# EAGLE design SCS (EAGLE 9.3.0)
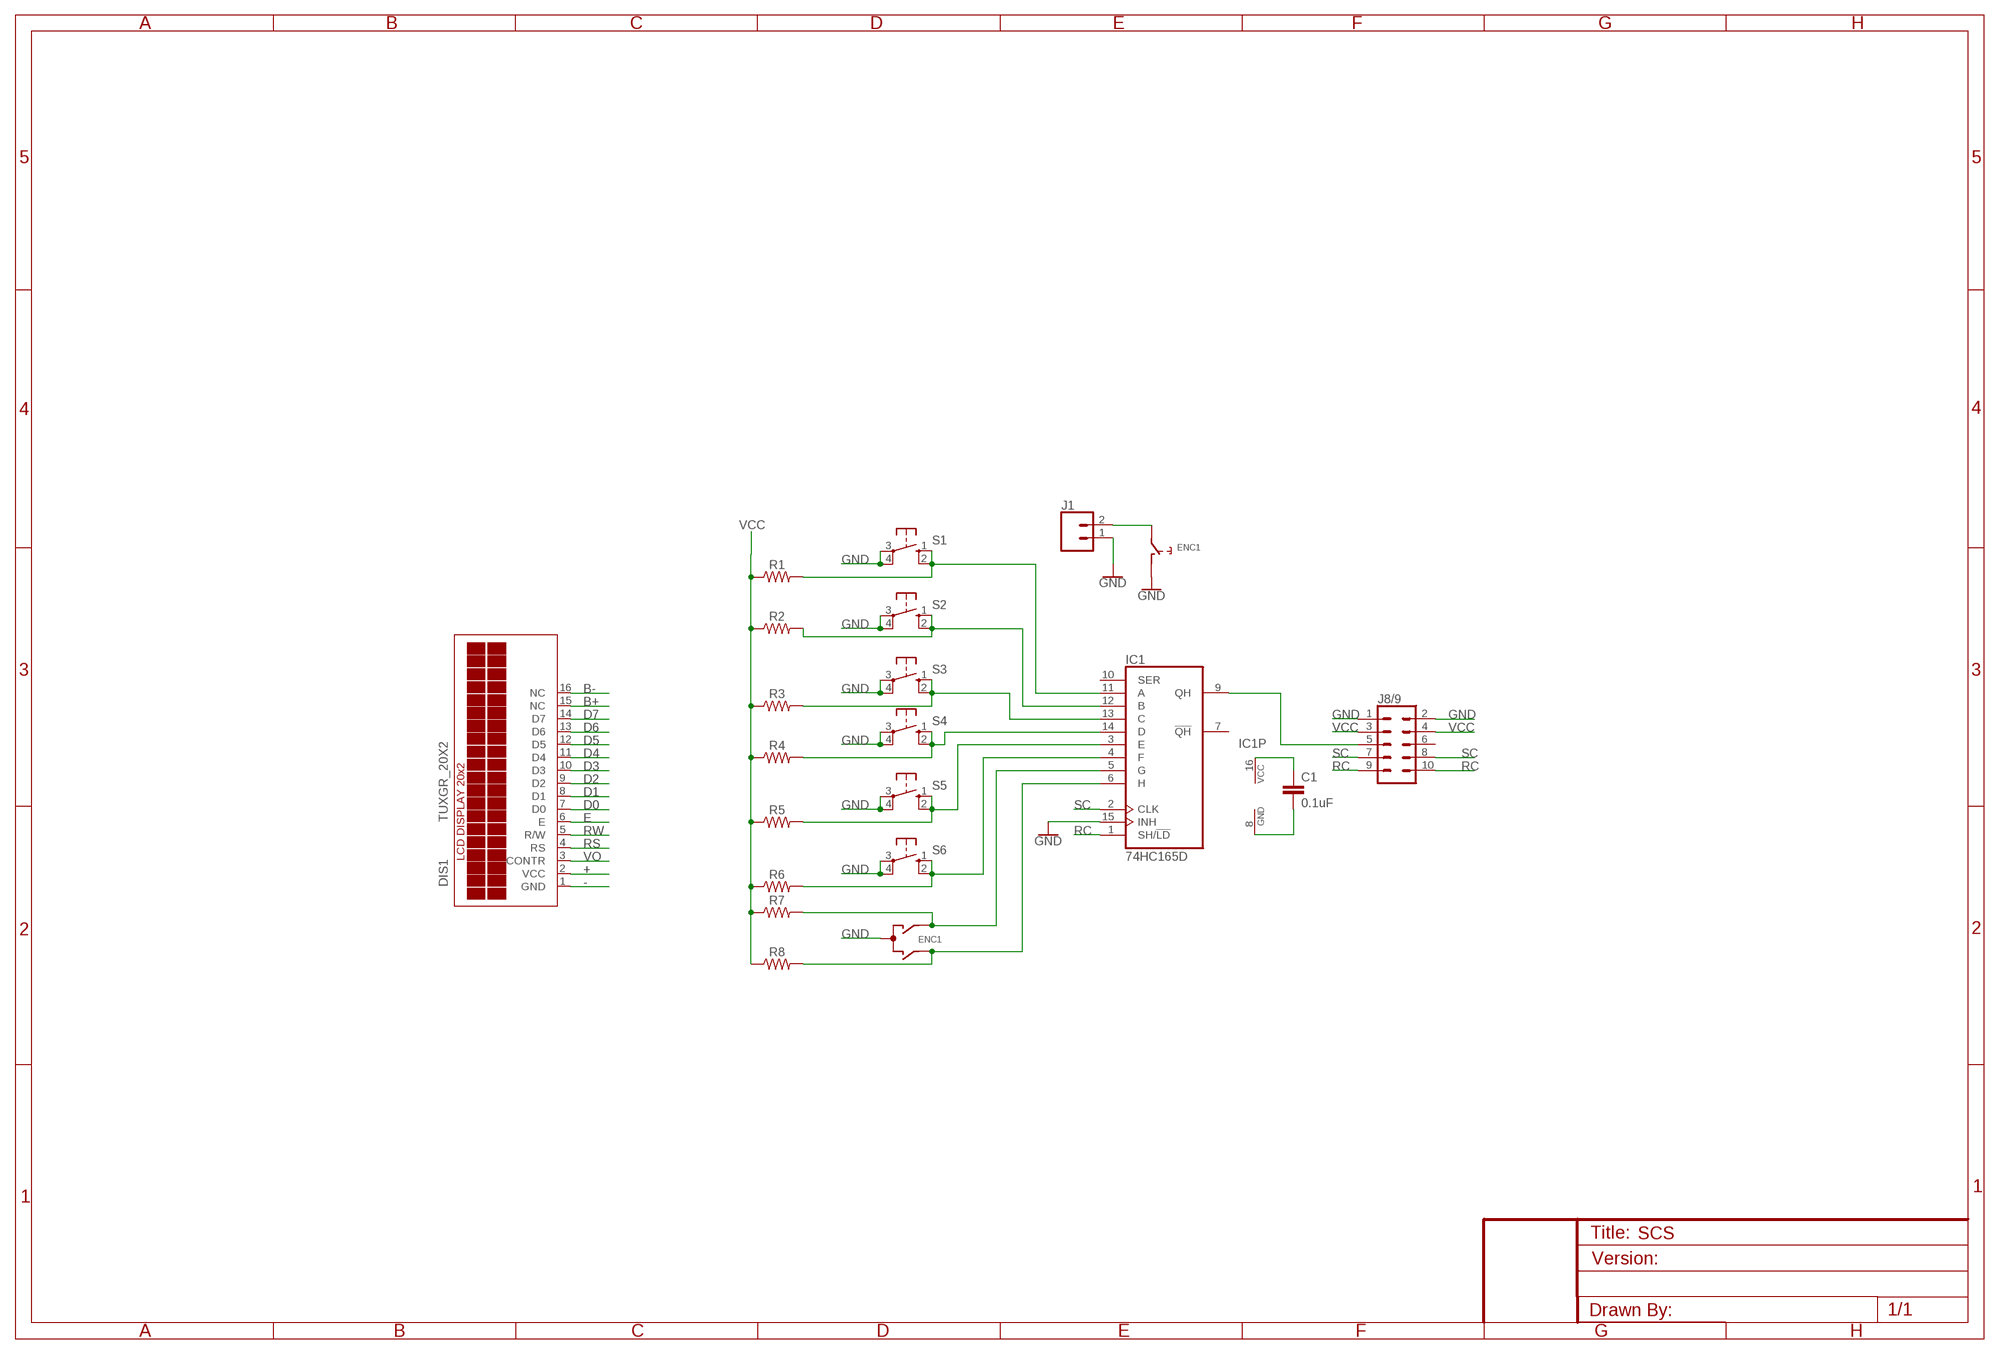
[diagram p0: schematic, sheet 1]

## Parts
C1  0.1uF  0.1UF-0603-25V-(+80/-20%)  [0603]
DIS1  TUXGR_20X2  [TUXGR_20X2]
ENC1  EC12E_SW  [ALPS_EC12E_SW]
IC1  74HC165D  [SO16]
J1  CONN_02  [1X02]
J8/9  CONN_05X2SHD_LOCK  [2X5-SHROUDED_LOCK]
R1  10k  10KOHM-0603-1/10W-1%  [0603]
R2  10k  10KOHM-0603-1/10W-1%  [0603]
R3  10k  10KOHM-0603-1/10W-1%  [0603]
R4  10k  10KOHM-0603-1/10W-1%  [0603]
R5  10k  10KOHM-0603-1/10W-1%  [0603]
R6  10k  10KOHM-0603-1/10W-1%  [0603]
R7  10k  10KOHM-0603-1/10W-1%  [0603]
R8  10k  10KOHM-0603-1/10W-1%  [0603]
S1  40-XX  [B3F-40XX]
S2  40-XX  [B3F-40XX]
S3  40-XX  [B3F-40XX]
S4  40-XX  [B3F-40XX]
S5  40-XX  [B3F-40XX]
S6  40-XX  [B3F-40XX]

## Nets
+: DIS1.2(VCC)
-: DIS1.1(GND)
B+: DIS1.15(NC)
B-: DIS1.16(NC)
D0: DIS1.7(D0)
D1: DIS1.8(D1)
D2: DIS1.9(D2)
D3: DIS1.10(D3)
D4: DIS1.11(D4)
D5: DIS1.12(D5)
D6: DIS1.13(D6)
D7: DIS1.14(D7)
E: DIS1.6(E)
GND: ENC1.C ENC1.D IC1.15(INH) J1.1 J8/9.1 J8/9.2 S1.3(P) S1.4(P1) S2.3(P) S2.4(P1) S3.3(P) S3.4(P1) S4.3(P) S4.4(P1) S5.3(P) S5.4(P1) S6.3(P) S6.4(P1)
N$1: IC1.3(E) R5.2 S5.1(S) S5.2(S1)
N$2: ENC1.A IC1.5(G) R7.2
N$3: IC1.4(F) R6.2 S6.1(S) S6.2(S1)
N$4: IC1.9(QH) J8/9.5
N$5: IC1.14(D) R4.2 S4.1(S) S4.2(S1)
N$6: IC1.13(C) R3.2 S3.1(S) S3.2(S1)
N$7: IC1.12(B) R2.2 S2.1(S) S2.2(S1)
N$8: IC1.11(A) R1.2 S1.1(S) S1.2(S1)
N$9: ENC1.B IC1.6(H) R8.2
N$11: ENC1.E J1.2
N$12: C1.1 IC1.16(VCC)
N$13: C1.2 IC1.8(GND)
RC: IC1.1(SH/!LD) J8/9.9 J8/9.10
RS: DIS1.4(RS)
RW: DIS1.5(R/W)
SC: IC1.2(CLK) J8/9.7 J8/9.8
VCC: J8/9.3 J8/9.4 R1.1 R2.1 R3.1 R4.1 R5.1 R6.1 R7.1 R8.1
VO: DIS1.3(CONTR)
Unconnected: ENC1.GND1(G) ENC1.GND2(G) IC1.7(!QH) IC1.10(SER) J8/9.6

## Library data of the parts
C1 = SparkFun-Capacitors:0.1UF: 0.1µF ceramic capacitors A capacitor is a passive two-terminal electrical component used to store electrical energy temporarily in an electric field.; PROD_ID: CAP-00810
DIS1 = display-lcd:TUXGR_20X2: Tuxgraphics LCD display 20x2 characters reflective, without background light Source: tuxgr_20x2.pdf; OC_FARNELL: unknown; OC_NEWARK: unknown
ENC1 = switch-alps:EC12E_SW: ALPS rotary Encoder EC12E series with switch; MPN: EC12E2424407; OC_FARNELL: 1520813; OC_NEWARK: 74M1068
IC1 = 74xx-eu:74*165: 8-bit parallel load SHIFT REGISTER
J1 = SparkFun-Connectors:CONN_02: Multi connection point. Often used as Generic Header-pin footprint for 0.1 inch spaced/style header connections On any of the 0.1 inch spaced packages, you can populate with these: Break Away Headers - Straight <https://www.sparkfun.com/products/116> (PRT-00116) Break Away Male Headers - Right Angle <https://www.sparkfun.com/products/553> (PRT-00553) Female Headers <https://www.sparkfun.com/products/115> (PRT-00115) Break Away Headers - Machine Pin <https://www.sparkfun.com/products/117> (PRT-00117) Break Away Female Headers - Swiss Machine Pin <https://www.sparkfun.com/products/743> (PRT-00743) For SCREWTERMINALS and SPRING TERMINALS visit here: Screw Terimnals on SparkFun.com <https://www.sparkfun.com/search/results?term=Screw+Terminals> (5mm/3.5mm/2.54mm spacing) This device is also useful as a general connection point to wire up your design to another part of your project. Our various solder wires solder well into these plated through hole pads. Hook-Up Wire - Assortment (Stranded, 22 AWG) <https://www.sparkfun.com/products/11375> (PRT-11375) Hook-Up Wire - Assortment (Solid Core, 22 AWG) <https://www.sparkfun.com/products/11367> (PRT-11367) View the entire wire category on our website here <https://www.sparkfun.com/categories/141> Special notes: Molex polarized connector foot print use with: PRT-08233 with associated crimp pins and housings. 2.54_SCREWTERM for use with PRT-10571. 3.5mm Screw Terminal footprints for PRT-08084 5mm Screw Terminal footprints for use with PRT-08432
J8/9 = SparkFun-Connectors:CONN_05X2: Multi connection point. Often used as Generic Header-pin footprint for 0.1 inch spaced/style header connections For AVR SPI programming port, see special device with nice symbol: "AVR_SPI_PROG_5x2.dev" You can populate with any combo of single row headers, but if you'd like an exact match, check these: 2x5 AVR ICSP Male Header <https://www.sparkfun.com/products/778> (PRT-00778) 2x5 Pin Shrouded Header <https://www.sparkfun.com/products/8506> (PRT-08506) On any of the 0.1 inch spaced packages, you can populate with these: Break Away Headers - Straight <https://www.sparkfun.com/products/116> (PRT-00116) Break Away Male Headers - Right Angle <https://www.sparkfun.com/products/553> (PRT-00553) Female Headers <https://www.sparkfun.com/products/115> (PRT-00115) Break Away Headers - Machine Pin <https://www.sparkfun.com/products/117> (PRT-00117) Break Away Female Headers - Swiss Machine Pin <https://www.sparkfun.com/products/743> (PRT-00743) Special note: the shrouded connector mates well with our 5x2 ribbon cables: 2x5 Pin IDC Ribbon Cable <https://www.sparkfun.com/products/8535> (PRT-08535); PROD_ID: CONN-08671; SF_ID: PRT-08506
R1-R8 = SparkFun-Resistors:10KOHM: 10kΩ resistor A resistor is a passive two-terminal electrical component that implements electrical resistance as a circuit element. Resistors act to reduce current flow, and, at the same time, act to lower voltage levels within circuits. - Wikipedia; PROD_ID: RES-00824
S1-S6 = adafruit:40-XX: OMRON SWITCH; MF: OMRON COMPONENTS USA; MPN: B3F-4000; OC_FARNELL: 176434; OC_NEWARK: 36K3105

## Net classes
0 default: width 0.508 mm, drill 1.016 mm, clearance 0.508 mm

## Board
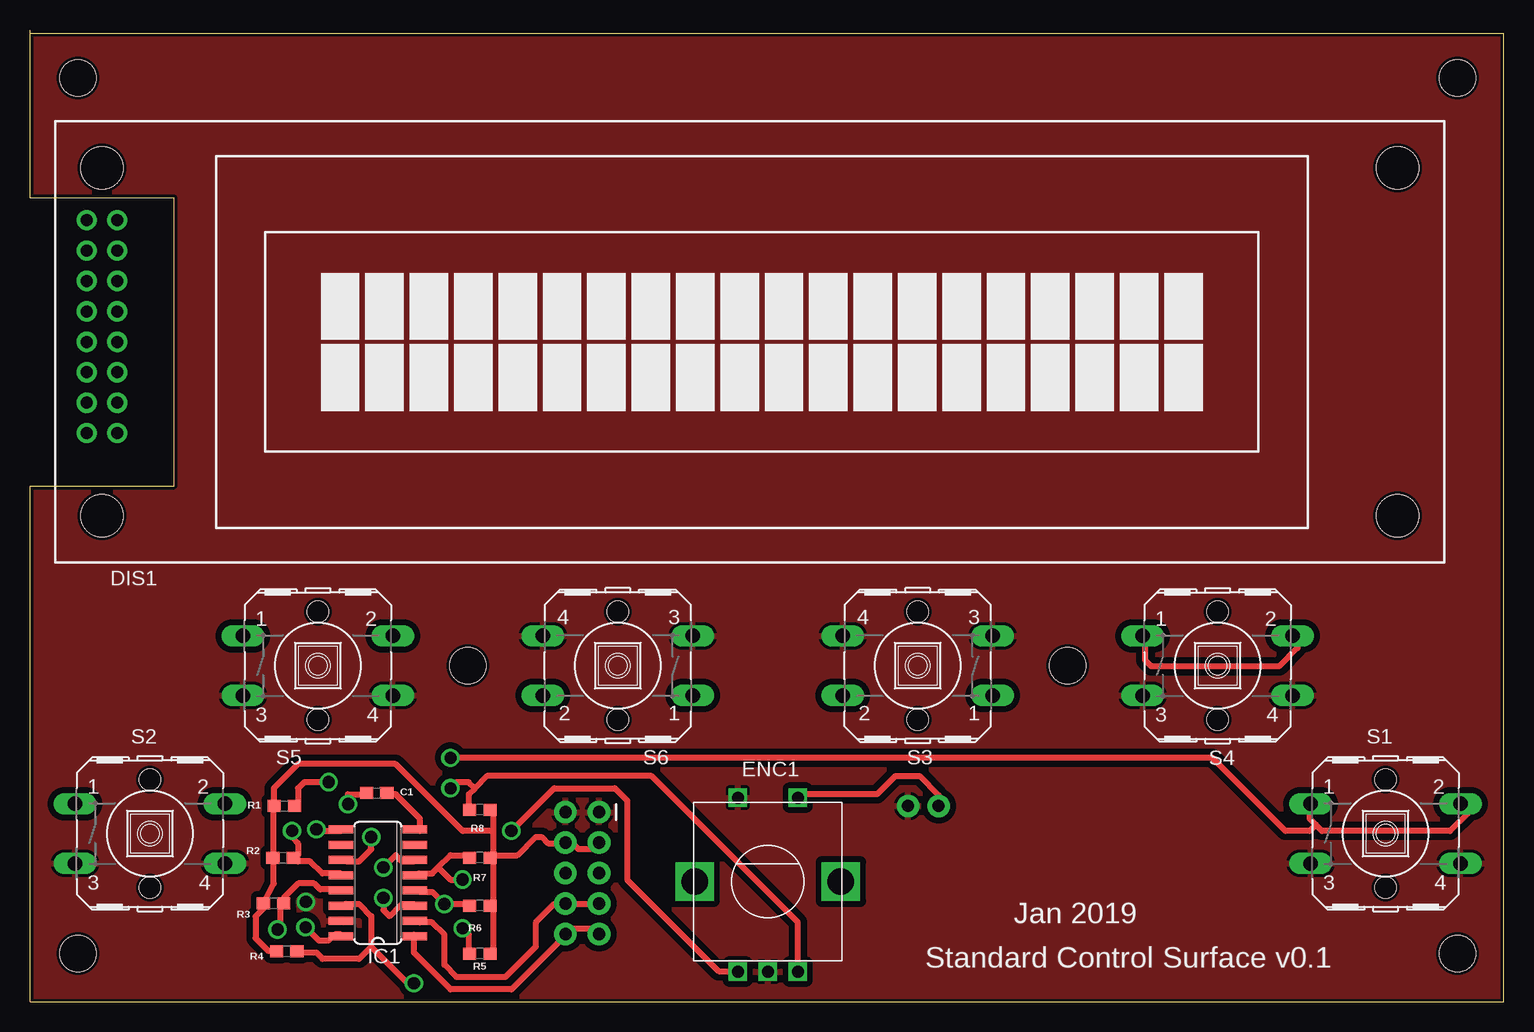
[diagram p1: board, top side]
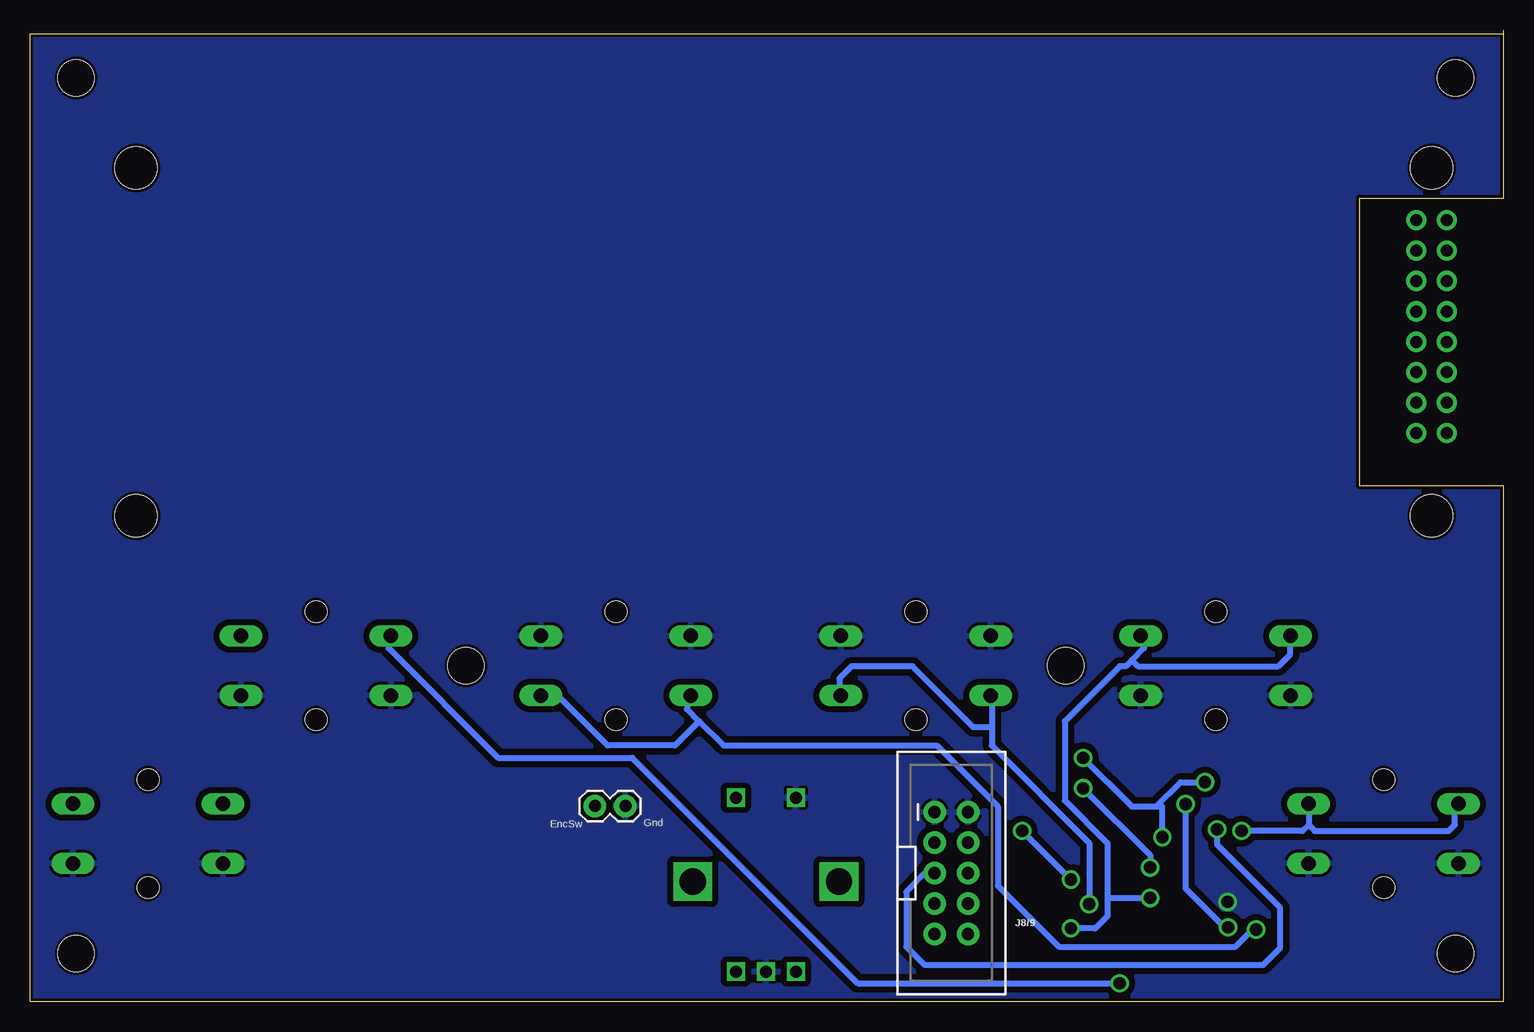
[diagram p2: board, bottom side, seen from below]

Size 122.84 x 81 mm. Coordinates in mm from the lower left corner, seen from the top.
Outline: 0,80.68 122.84,80.68 122.84,0 0,0 0,43 12,43 12,67 0,67 0,81
Copper layers (1*16): Top 0.035mm / dielectric 1.5mm / Bottom 0.035mm
Design rules "dirt_cheap_dirty_boards.v1.1": minimum track width 6mil, minimum drill 12mil, track to track 6mil, track to pad 6mil, pad to pad 6mil, via to via 6mil, smd to smd 0mil, copper to edge 10mil, drill to drill 10mil, minimum pad ring 10mil, minimum via ring 6mil, stop-mask expansion 2mil, vias tented up to drill 25mil, thermal gap 10mil
Holes 3 mm at 4,77 119,77 119,4 4,4 36.5,28 86.5,28

### Footprints (pad centres in the part's own frame; a part is rotated, then mirrored left to right if it is on the bottom)
0603 = smd 1.1 x 1: 1 -0.85,0; 2 0.85,0
TUXGR_20X2 = drill 1 pad 1.676: 1 -52.73,-7.62; 2 -55.27,-7.62; 3 -52.73,-5.08; 4 -55.27,-5.08; 5 -52.73,-2.54; 6 -55.27,-2.54; 7 -52.73,0; 8 -55.27,0; 9 -52.73,2.54; 10 -55.27,2.54; 11 -52.73,5.08; 12 -55.27,5.08; 13 -52.73,7.62; 14 -55.27,7.62; 15 -52.73,10.16; 16 -55.27,10.16 | hole 3.5: -54,-14.5; 54,-14.5; -54,14.5; 54,14.5
ALPS_EC12E_SW = drill 1 square: A -2.5,-7.5; B 2.5,-7.5; C 0,-7.5; D -2.5,7; E 2.5,7 | drill 2.2 square: GND1 -6.1,0; GND2 6.1,0
SO16 = smd 0.66 x 2.032: 1 -4.445,-3.073; 2 -3.175,-3.073; 3 -1.905,-3.073; 4 -0.635,-3.073; 5 0.635,-3.073; 6 1.905,-3.073; 7 3.175,-3.073; 8 4.445,-3.073; 9 4.445,3.073; 10 3.175,3.073; 11 1.905,3.073; 12 0.635,3.073; 13 -0.635,3.073; 14 -1.905,3.073; 15 -3.175,3.073; 16 -4.445,3.073
1X02 = drill 1.016 pad 1.88: 1 0,0; 2 2.54,0
2X5-SHROUDED_LOCK = drill 1.016 pad 1.88: 1 -1.397,5.08; 2 1.397,5.08; 3 -1.397,2.54; 4 1.397,2.54; 5 -1.397,0; 6 1.397,0; 7 -1.397,-2.54; 8 1.397,-2.54; 9 -1.397,-5.08; 10 1.397,-5.08
B3F-40XX = drill 1.194 long: 1 -6.248,2.489; 2 6.248,2.489; 3 -6.248,-2.489; 4 6.248,-2.489 | hole 1.803: 0,-4.496; 0,4.496

### Placement (x,y rotation side)
C1  28.9,17.4 0 top
DIS1  60,55 0 top
ENC1  61.5,10 0 top
IC1  29,9.9 90 top
J1  73.2,16.3 180 bottom
J8/9  46.04,10.71 0 bottom
R1  21.2,16.3 0 top
R2  21.1,12 0 top
R3  20.3,8.2 0 top
R4  21.4,4.2 0 top
R5  37.5,4 180 top
R6  37.5,8 180 top
R7  37.5,12 180 top
R8  37.5,16 180 top
S1  113,14 0 top
S2  10,14 0 top
S3  74,28 180 top
S4  99,28 0 top
S5  24,28 0 top
S6  49,28 180 top

### Tracks (layer width: path | path; a pad name or v marks a point on that pad's centre or on a via)
GND  (via drill 1.02)
  other vias: 23,8.3
  pour Top: -2,86 130,86 130,-6 -2,-6
  pour Bottom: -2,86 130,86 130,-6 -2,-6
N$1  (via drill 1.02)
  Top 0.508: v36.07,6.1 36.58,5.59 36.58,4.06 R5.2 | v29.46,8.64 29.46,7.62 29.97,7.11 30.99,8.13 32,8.13 IC1.3
  Bottom 0.508: v36.07,6.1 34.04,6.1 33.02,7.11 33.02,8.64 | 33.02,8.64 33.02,13.21 36.58,16.76 36.58,23.37 32,27.94 31.5,27.94 30.99,28.45 | 30.99,28.45 29.97,29.46 29.97,30.48 S5.2 | 33.02,8.64 v29.46,8.64 | 30.99,28.45 30.48,27.94 18.8,27.94 17.78,28.96 17.78,30.48 S5.1
N$2  (via drill 1.02)
  Top 0.508: 34.04,11.18 33.53,10.67 32.51,10.67 IC1.5 | 34.04,11.18 35.05,12.19 36.58,12.19 R7.2 | v40.13,14.22 43.69,17.78 48.77,17.78 49.78,16.76 49.78,10.16 57.4,2.54 58.93,2.54 ENC1.A | v36.07,10.16 35.05,10.16 34.04,11.18
  Bottom 0.508: v36.07,10.16 v40.13,14.22
N$3  (via drill 1.02)
  Top 0.508: R6.2 36.58,8.13 v34.54,8.13 33.53,9.14 32.51,9.14 IC1.4
  Bottom 0.508: v34.54,8.13 34.54,13.21 42.67,21.34 42.67,22.86 | 42.67,22.86 42.67,25.4 S6.2 | 42.67,22.86 44.2,22.86 49.28,27.94 54.36,27.94 55.37,26.92 55.37,25.91 S6.1
N$4  (via drill 1.02)
  Top 0.508: v23.88,14.35 24,14.22 25.91,14.22 IC1.9
  Bottom 0.508: v23.88,14.35 23.88,13.08 18.61,7.81 18.61,4.48 20.04,3.05 48.26,3.05 49.78,4.57 49.78,9.14 48.26,10.67 47.75,10.16 47.24,10.67 J8/9.5
N$5  (via drill 1.02)
  Top 0.508: 28.45,4.57 27.43,3.56 24.38,3.56 23.88,4.06 22.35,4.06 R4.2 | 28.45,4.57 28.45,7.11 27.43,8.13 26.42,8.13 IC1.14 | S4.1 92.96,30.48 92.96,28.45 93.47,27.94 104.14,27.94 105.66,29.46 105.66,30.48 S4.2 | 28.45,4.57 31.5,1.52 v32,1.52
  Bottom 0.508: v32,1.52 53.85,1.52 72.64,20.32 83.82,20.32 92.96,29.46 92.96,30.48 S4.1
N$6  (via drill 1.02)
  Top 0.508: IC1.13 25.85,9.34 24.19,9.34 23.68,9.85 22.37,9.85 21.15,8.63 R3.2 20.85,7.9 20.85,6.21 v20.64,6
  Bottom 0.508: v20.64,6 20.93,6 22.35,4.57 37.08,4.57 42.16,9.65 42.16,16.26 47.24,21.34 65.02,21.34 67.06,23.37 | 67.06,23.37 68.07,24.38 68.07,25.4 S3.2 | 67.06,23.37 69.09,21.34 74.68,21.34 78.74,25.4 79.76,25.4 S3.1
N$7  (via drill 1.02)
  Top 0.508: IC1.12 25.91,10.67 24.38,10.67 23.37,11.68 22.35,11.68 R2.2 22.35,12.19 22.35,13.21 21.84,13.72 v21.84,14.22
  Bottom 0.508: v21.84,14.22 16.76,14.22 16.26,14.73 | 16.26,14.73 16.26,16.26 S2.2 | 16.26,14.73 15.75,14.22 4.57,14.22 4.06,14.73 4.06,16.26 S2.1
N$8  (via drill 1.02)
  Top 0.508: v24.89,18.29 22.86,18.29 22.35,17.78 22.35,16.76 R1.2 | v28.45,13.72 28.45,12.7 27.43,11.68 26.42,11.68 IC1.11 | 107.19,14.73 107.7,14.22 118.36,14.22 119.89,15.75 119.89,16.26 119.38,16.76 S1.2 | 107.19,14.73 106.68,15.24 106.68,16.26 S1.1 | v35.05,20.32 98.55,20.32 104.65,14.22 106.68,14.22 107.19,14.73
  Bottom 0.508: v24.89,18.29 26.92,18.29 28.95,16.26 | v28.45,13.72 28.45,16.26 28.95,16.26 | 28.95,16.26 30.99,16.26 v35.05,20.32
N$9  (via drill 1.02)
  Top 0.508: 37.08,17.78 38.1,18.8 51.82,18.8 64.01,6.6 64.01,2.54 ENC1.B | 37.08,17.78 36.58,17.27 36.58,16.26 R8.2 | v29.46,11.18 30.48,12.19 30.99,11.68 32,11.68 IC1.6 | v35.05,17.78 35.56,18.29 36.58,18.29 37.08,17.78
  Bottom 0.508: v29.46,11.18 29.46,12.19 v35.05,17.78
N$11
  Top 0.508: ENC1.E 64.01,17.27 70.61,17.27 72.14,18.8 74.17,18.8 75.74,17.22 J1.2
N$12  (via drill 1.02)
  Top 0.508: v26.51,16.46 26.51,17.27 27.94,17.27 C1.1 | v22.97,6.2 24.08,5.08 24.89,5.08 25.4,5.59 25.91,5.59 IC1.16
  Bottom 0.508: v26.51,16.46 26.51,9.44 23.27,6.2 v22.97,6.2
N$13
  Top 0.508: C1.2 29.97,17.27 30.48,17.27 32.51,15.24 32.51,14.22 IC1.8
RC
  Top 0.508: IC1.1 32,5.59 32,4.06 35.05,1.02 40.13,1.02 44.2,5.08 44.7,5.08 44.7,5.59 J8/9.10 44.7,6.1 47.24,6.1 J8/9.9
SC
  Top 0.508: 44.7,8.13 44.7,7.62 44.2,7.62 43.69,8.13 42.16,6.6 42.16,4.57 39.62,2.03 35.56,2.03 34.54,3.05 34.54,5.59 33.53,6.6 32.51,6.6 IC1.2 | 44.7,8.13 47.24,8.13 J8/9.7 | 44.7,8.13 J8/9.8
VCC
  Top 0.508: R4.1 19.89,4.2 18.8,5.29 18.8,7.1 19.81,8.11 R3.1 20.32,9.85 20.32,11.68 R2.1 20.32,12.19 20.32,16.26 R1.1 20.32,16.76 20.32,17.78 22.35,19.81 30.48,19.81 36.07,14.22 38.61,14.22 | J8/9.3 47.24,13.21 46.74,12.7 45.72,12.7 45.21,13.21 44.7,13.21 J8/9.4 44.2,13.21 43.18,13.21 42.67,13.72 42.16,13.72 40.64,12.19 38.61,12.19 | R5.1 38.61,4.06 38.61,7.62 R6.1 38.61,8.13 38.61,11.68 R7.1 38.61,12.19 | 38.61,14.22 38.61,15.75 R8.1 | 38.61,14.22 38.61,12.19

### Text on the board
tPlace: Jan 2019 | Standard Control Surface v0.1
bPlace: Gnd | EncSw